# Altium schematic sheet obc_imu.SchDoc
size A
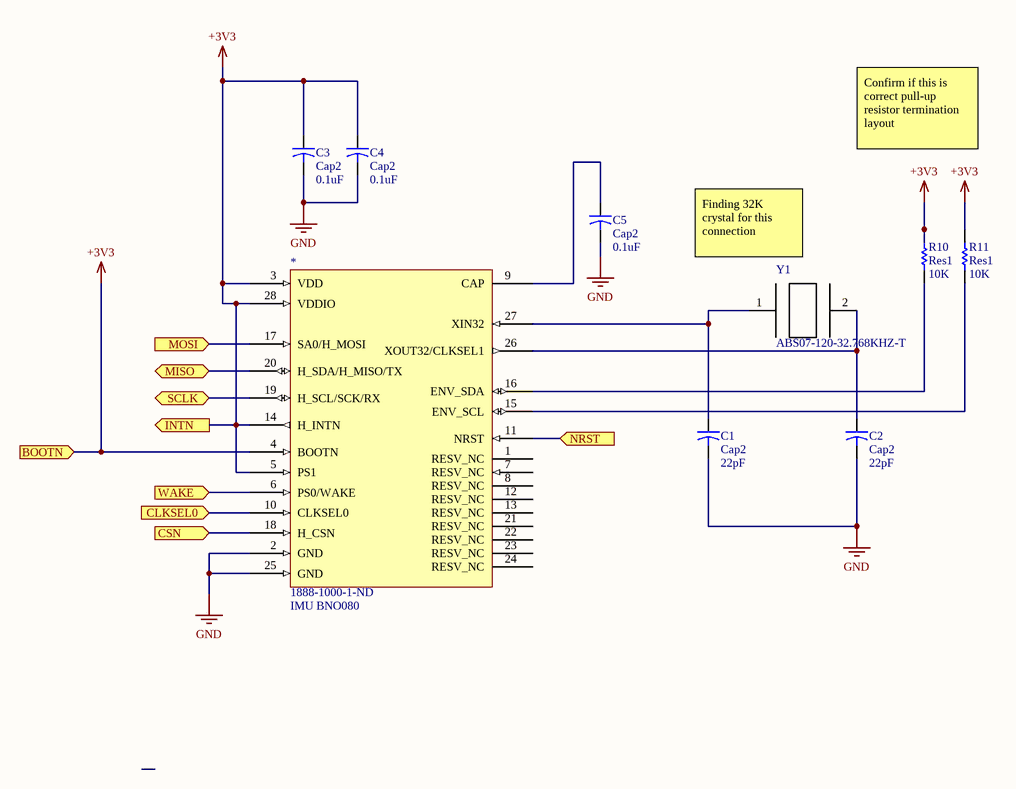
[diagram p0: obc_imu.SchDoc]

## Parts
*  IMU BNO080
C1  Cap2  value 22pF  [CAPR5-4X5]
C2  Cap2  value 22pF  [CAPR5-4X5]
C3  Cap2  value 0.1uF  [CAPR5-4X5]
C4  Cap2  value 0.1uF  [CAPR5-4X5]
C5  Cap2  value 0.1uF  [CAPR5-4X5]
R10  Res1  value 10K  [AXIAL-0.3]
R11  Res1  value 10K  [AXIAL-0.3]
Y1  ABS07-120-32.768KHZ-T  [XTAL_ABS07-120-32.768KHZ-T]

## Ports
BOOTN (in), CLKSEL0 (in), CSN (in), INTN (out), MISO (bidir), MOSI (in), NRST (in), SCLK (bidir), WAKE (in)

## Nets
+3V3: *.3(VDD) *.4(BOOTN) *.5(PS1) *.14(H_INTN) *.28(VDDIO) C3.1 C4.1 R10.2 R11.2 ; port INTN, port BOOTN
GND: *.2(GND) *.25(GND) C1.2 C2.2 C3.2 C4.2 C5.2
CLKSEL0: *.10(CLKSEL0) ; port CLKSEL0
CSN: *.18(H_CSN) ; port CSN
MISO: *.20(H_SDA/H_MISO/TX) ; port MISO
MOSI: *.17(SA0/H_MOSI) ; port MOSI
NRST: *.11(NRST) ; port NRST
SCLK: *.19(H_SCL/SCK/RX) ; port SCLK
WAKE: *.6(PS0/WAKE) ; port WAKE
Net*_9: *.9(CAP) C5.1
Net*_15: *.15(ENV_SCL) R11.1
Net*_16: *.16(ENV_SDA) R10.1
Net*_26: *.26(XOUT32/CLKSEL1) C2.1 Y1.2
Net*_27: *.27(XIN32) C1.1 Y1.1

Not connected (* = marked no-connect by the designer): * 1(RESV_NC) 7(RESV_NC) 8(RESV_NC) 12(RESV_NC) 13(RESV_NC) 21(RESV_NC) 22(RESV_NC) 23(RESV_NC) 24(RESV_NC)

## Notes on the sheet
- Confirm if this is correct pull-up resistor termination layout
- Finding 32K crystal for this connection
- (in symbol IMU BNO080) 1888-1000-1-ND

## Library data of the parts
* = IMU BNO080: ACCEL/GYRO/MAG I2C 32BIT
C1-C5 = Cap2: Capacitor; Published: 23-Sep-2002; PackageReference: CAPR5-4X5; Publisher: Altium Limited; PackageDescription: Capacitor; 2 Leads
R10 R11 = Res1: Resistor; Published: 8-Jun-2000; LatestRevisionDate: 17-Jul-2002; LatestRevisionNote: Re-released for DXP Platform.; PackageReference: AXIAL-0.3; Publisher: Altium Limited; PackageDescription: Axial Device, Thru-Hole; 2 Leads; 0.3 in Pin Spacing
Y1 = ABS07-120-32.768KHZ-T: 3.2 x 1.5mm, 32.768KHZ Xtal 6pf, 20ppm, -40+85C, ESR 60kOhm, ST Micro Ref Design Crystal for STM32L; MF: Abracon; MP: ABS07-120-32.768KHZ-T; SnapEDA_Link: https://www.snapeda.com/parts/ABS07-120-32.768KHZ-T/Abracon%20LLC/view-part/?ref=snap; Package: SMD-2 Abracon; Price: 0.37 USD; Availability: Good; Value: *